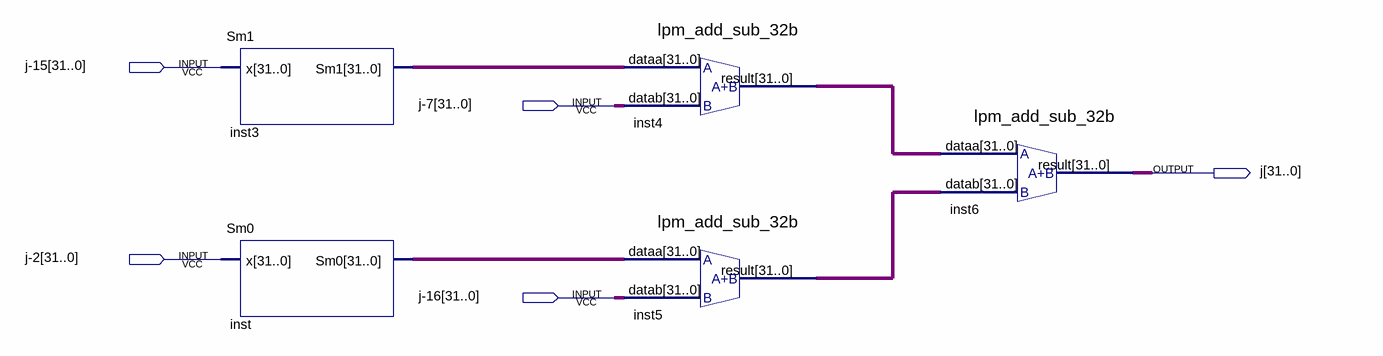
[diagram p0: schematic sheet]
// Quartus schematic wj.bdf as structural Verilog: 5 symbols, 5 pins
module wj (
  input  [31:0] \j-15 ,
  input  [31:0] \j-7 ,
  input  [31:0] \j-2 ,
  input  [31:0] \j-16 ,
  output [31:0] j
);

  wire [31:0] inst3_sm1, inst4_result, inst5_result, inst_sm0;

  Sm1 inst3 (.x(\j-15 ), .Sm1(inst3_sm1));
  Sm0 inst (.x(\j-2 ), .Sm0(inst_sm0));
  lpm_add_sub_32b inst4 (.dataa(inst3_sm1), .datab(\j-7 ), .result(inst4_result));
  lpm_add_sub_32b inst5 (.dataa(inst_sm0), .datab(\j-16 ), .result(inst5_result));
  lpm_add_sub_32b inst6 (.dataa(inst4_result), .datab(inst5_result), .result(j));
endmodule
